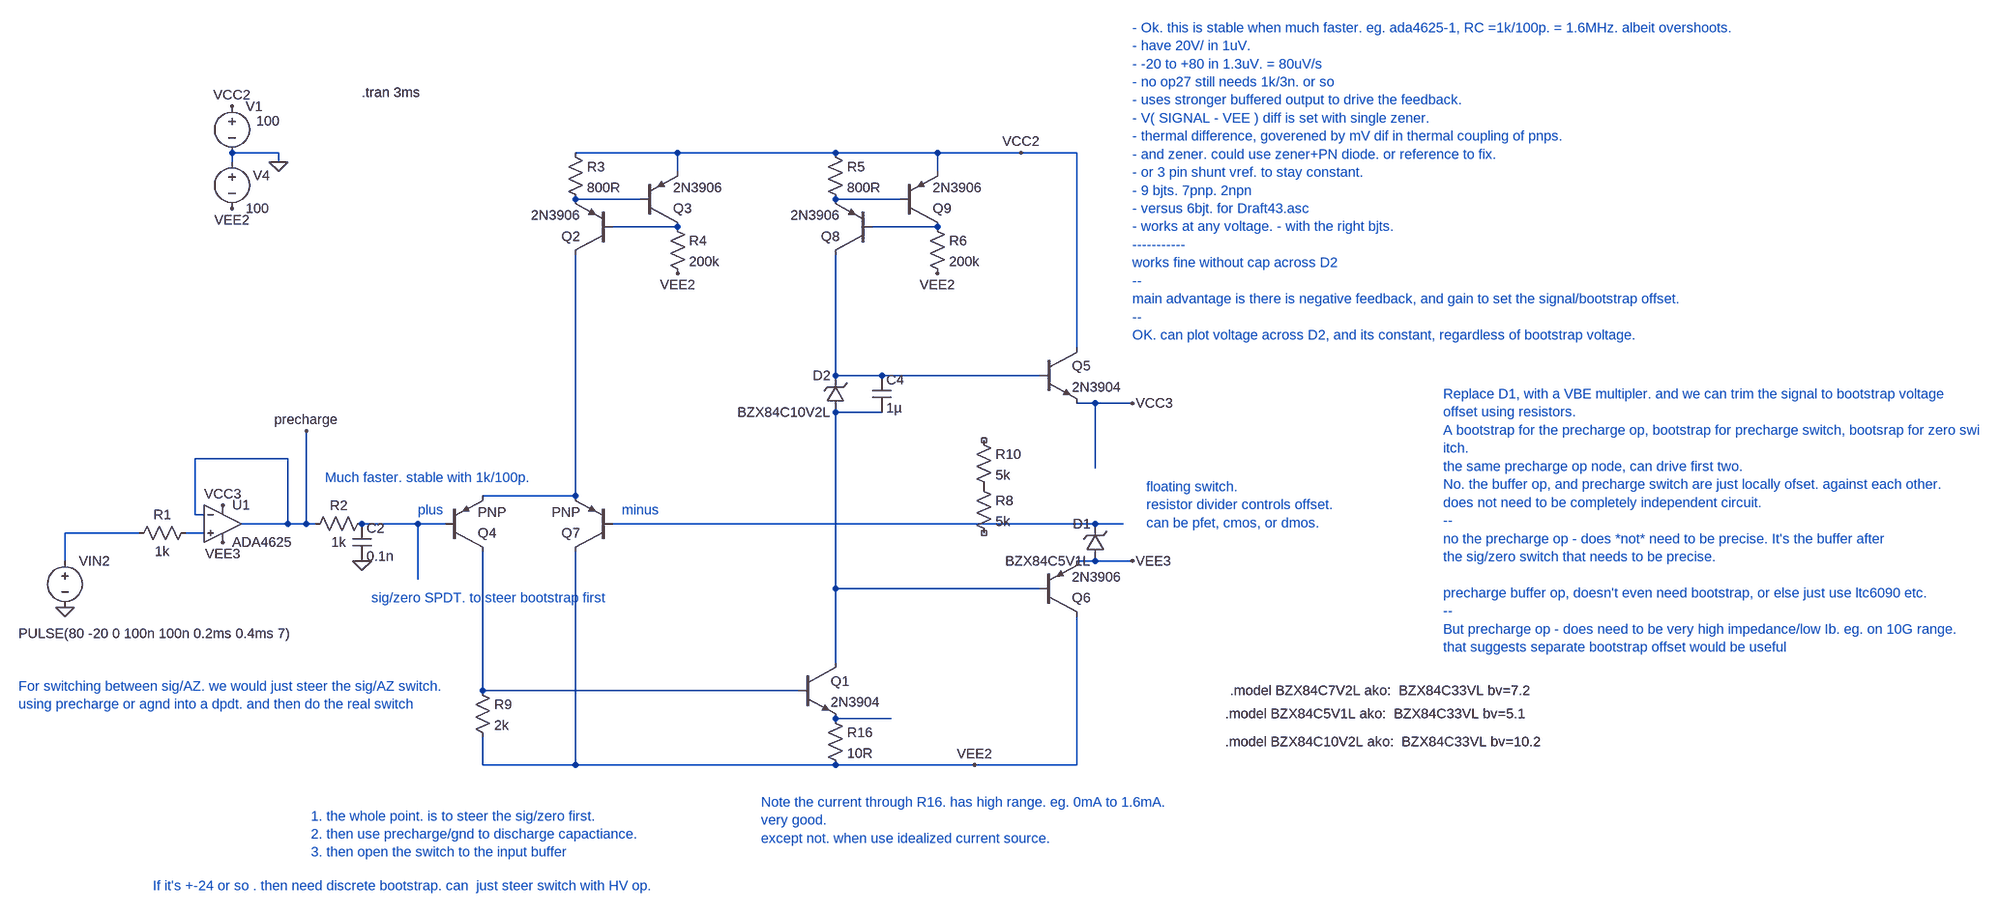
[diagram p0: schematic Draft51.asc]
Draft51.asc, the LTspice schematic file:
Version 4
SHEET 1 2756 992
WIRE -256 -288 -336 -288
WIRE 432 -288 256 -288
WIRE 704 -288 432 -288
WIRE 880 -288 704 -288
WIRE 1024 -288 880 -288
WIRE 1120 -288 1024 -288
WIRE -336 -272 -336 -288
WIRE -256 -272 -256 -288
WIRE 432 -256 432 -288
WIRE 880 -256 880 -288
WIRE 368 -208 256 -208
WIRE 816 -208 704 -208
WIRE 432 -160 320 -160
WIRE 880 -160 768 -160
WIRE 1120 48 1120 -288
WIRE 704 96 704 -112
WIRE 784 96 704 96
WIRE 1056 96 784 96
WIRE 1152 144 1120 144
WIRE 1216 144 1152 144
WIRE 784 160 704 160
WIRE -240 240 -400 240
WIRE 1152 256 1152 144
WIRE 256 304 256 -112
WIRE 256 304 96 304
WIRE -400 336 -400 240
WIRE -384 336 -400 336
WIRE -240 352 -240 240
WIRE -240 352 -320 352
WIRE -208 352 -208 192
WIRE -208 352 -240 352
WIRE -192 352 -208 352
WIRE -16 352 -112 352
WIRE 32 352 -16 352
WIRE 1152 352 320 352
WIRE 1200 352 1152 352
WIRE -496 368 -624 368
WIRE -384 368 -416 368
WIRE -624 416 -624 368
WIRE 1152 416 1120 416
WIRE 1216 416 1152 416
WIRE -16 448 -16 352
WIRE 704 464 704 160
WIRE 1056 464 704 464
WIRE 704 592 704 464
WIRE 96 640 96 400
WIRE 640 640 96 640
WIRE 800 688 704 688
WIRE 96 768 96 720
WIRE 256 768 256 400
WIRE 256 768 96 768
WIRE 704 768 256 768
WIRE 944 768 704 768
WIRE 1120 768 1120 512
WIRE 1120 768 944 768
FLAG -256 -272 0
FLAG -336 -368 VCC2
FLAG -336 -192 VEE2
FLAG 944 768 VEE2
FLAG -624 496 0
FLAG 1216 144 VCC3
FLAG 1216 416 VEE3
FLAG -352 320 VCC3
FLAG -352 384 VEE3
FLAG -112 416 0
FLAG 432 -80 VEE2
FLAG 1024 -288 VCC2
FLAG 880 -80 VEE2
FLAG -208 192 precharge
SYMBOL voltage -336 -384 R0
WINDOW 123 0 0 Left 0
WINDOW 39 0 0 Left 0
WINDOW 3 42 41 Left 2
SYMATTR Value 100
SYMATTR InstName V1
SYMBOL voltage -336 -288 R0
WINDOW 123 0 0 Left 0
WINDOW 39 0 0 Left 0
WINDOW 0 36 39 Left 2
SYMATTR InstName V4
SYMATTR Value 100
SYMBOL npn 1056 48 R0
SYMATTR InstName Q5
SYMATTR Value 2N3904
SYMBOL pnp 1056 512 M180
SYMATTR InstName Q6
SYMATTR Value 2N3906
SYMBOL res 80 624 R0
SYMATTR InstName R9
SYMATTR Value 2k
SYMBOL res 688 672 R0
SYMATTR InstName R16
SYMATTR Value 10R
SYMBOL pnp 32 400 M180
SYMATTR InstName Q4
SYMBOL pnp 320 400 R180
SYMATTR InstName Q7
SYMBOL voltage -624 400 R0
WINDOW 123 0 0 Left 0
WINDOW 39 0 0 Left 0
WINDOW 3 -80 141 Left 2
SYMATTR Value PULSE(80 -20 0 100n 100n 0.2ms 0.4ms 7)
SYMATTR InstName VIN2
SYMBOL res -400 352 R90
WINDOW 0 0 56 VBottom 2
WINDOW 3 32 56 VTop 2
SYMATTR InstName R1
SYMATTR Value 1k
SYMBOL res -96 336 R90
WINDOW 0 0 56 VBottom 2
WINDOW 3 32 56 VTop 2
SYMATTR InstName R2
SYMATTR Value 1k
SYMBOL cap -128 352 R0
SYMATTR InstName C2
SYMATTR Value 0.1n
SYMBOL cap 768 96 R0
SYMATTR InstName C4
SYMATTR Value 1µ
SYMBOL OpAmps\\ADA4625 -352 288 R0
SYMATTR InstName U1
SYMBOL zener 720 160 R180
WINDOW 0 24 64 Left 2
WINDOW 3 24 0 Left 2
SYMATTR InstName D2
SYMATTR Value BZX84C10V2L
SYMBOL npn 640 592 R0
SYMATTR InstName Q1
SYMATTR Value 2N3904
SYMBOL pnp 320 -112 R180
SYMATTR InstName Q2
SYMATTR Value 2N3906
SYMBOL pnp 368 -160 M180
SYMATTR InstName Q3
SYMATTR Value 2N3906
SYMBOL res 240 -304 R0
SYMATTR InstName R3
SYMATTR Value 800R
SYMBOL res 416 -176 R0
SYMATTR InstName R4
SYMATTR Value 200k
SYMBOL pnp 768 -112 R180
SYMATTR InstName Q8
SYMATTR Value 2N3906
SYMBOL pnp 816 -160 M180
SYMATTR InstName Q9
SYMATTR Value 2N3906
SYMBOL res 688 -304 R0
SYMATTR InstName R5
SYMATTR Value 800R
SYMBOL res 864 -176 R0
SYMATTR InstName R6
SYMATTR Value 200k
SYMBOL res 944 272 R0
SYMATTR InstName R8
SYMATTR Value 5k
SYMBOL res 944 192 R0
SYMATTR InstName R10
SYMATTR Value 5k
SYMBOL zener 1168 416 R180
WINDOW 0 24 64 Left 2
WINDOW 3 24 0 Left 2
SYMATTR InstName D1
SYMATTR Value BZX84C5V1L
TEXT -112 -392 Left 2 !.tran 3ms
TEXT 336 328 Left 2 ;minus
TEXT 576 832 Left 2 ;Note the current through R16. has high range. eg. 0mA to 1.6mA.\nvery good.\nexcept not. when use idealized current source.
TEXT -16 328 Left 2 ;plus
TEXT 1376 680 Left 2 !.model BZX84C5V1L ako:  BZX84C33VL bv=5.1
TEXT 1384 640 Left 2 !.model BZX84C7V2L ako:  BZX84C33VL bv=7.2
TEXT 1216 -504 Left 2 ;- Ok. this is stable when much faster. eg. ada4625-1, RC =1k/100p. = 1.6MHz. albeit overshoots.\n- have 20V/ in 1uV.\n- -20 to +80 in 1.3uV. = 80uV/s\n- no op27 still needs 1k/3n. or so\n- uses stronger buffered output to drive the feedback.\n- V( SIGNAL - VEE ) diff is set with single zener.\n- thermal difference, goverened by mV dif in thermal coupling of pnps.\n- and zener. could use zener+PN diode. or reference to fix.\n- or 3 pin shunt vref. to stay constant.\n- 9 bjts. 7pnp. 2npn\n- versus 6bjt. for Draft43.asc\n- works at any voltage. - with the right bjts.\n-----------\nworks fine without cap across D2\n--\nmain advantage is there is negative feedback, and gain to set the signal/bootstrap offset.\n--\nOK. can plot voltage across D2, and its constant, regardless of bootstrap voltage.
TEXT -176 272 Left 2 ;Much faster. stable with 1k/100p.
TEXT 1376 728 Left 2 !.model BZX84C10V2L ako:  BZX84C33VL bv=10.2
TEXT 1752 128 Left 2 ;Replace D1, with a VBE multipler. and we can trim the signal to bootstrap voltage\noffset using resistors.\nA bootstrap for the precharge op, bootstrap for precharge switch, bootsrap for zero swi\nitch.\nthe same precharge op node, can drive first two.\nNo. the buffer op, and precharge switch are just locally ofset. against each other.\ndoes not need to be completely independent circuit.\n--\nno the precharge op - does *not* need to be precise. It's the buffer after\nthe sig/zero switch that needs to be precise.\n \nprecharge buffer op, doesn't even need bootstrap, or else just use ltc6090 etc.\n--\nBut precharge op - does need to be very high impedance/low Ib. eg. on 10G range.\nthat suggests separate bootstrap offset would be useful
TEXT -704 632 Left 2 ;For switching between sig/AZ. we would just steer the sig/AZ switch.\nusing precharge or agnd into a dpdt. and then do the real switch
TEXT -96 480 Left 2 ;sig/zero SPDT. to steer bootstrap first
TEXT 1240 288 Left 2 ;floating switch. \nresistor divider controls offset.\ncan be pfet, cmos, or dmos.
TEXT -200 856 Left 2 ;1. the whole point. is to steer the sig/zero first. \n2. then use precharge/gnd to discharge capactiance.\n3. then open the switch to the input buffer
TEXT -472 976 Left 2 ;If it's +-24 or so . then need discrete bootstrap. can  just steer switch with HV op.

The netlist it stands for:
* Draft51.asc
V1 VCC2 0 100
V4 0 VEE2 100
Q5 VCC2 N005 VCC3 0 2N3904
Q6 VEE2 N006 VEE3 0 2N3906
R9 N012 VEE2 2k
R16 N013 VEE2 10R
Q4 N012 N008 N007 0 PNP
Q7 VEE2 N009 N007 0 PNP
VIN2 N010 0 PULSE(80 -20 0 100n 100n 0.2ms 0.4ms 7)
R1 N011 N010 1k
R2 N008 precharge 1k
C2 N008 0 0.1n
C4 N005 N006 1µ
XU1 N011 precharge VCC3 VEE3 precharge ADA4625  ; pins In+ In- V+ V- OUT
D2 N006 N005 BZX84C10V2L
Q1 N006 N012 N013 0 2N3904
Q2 N007 N003 N001 0 2N3906
Q3 N003 N001 VCC2 0 2N3906
R3 VCC2 N001 800R
R4 N003 VEE2 200k
Q8 N005 N004 N002 0 2N3906
Q9 N004 N002 VCC2 0 2N3906
R5 VCC2 N002 800R
R6 N004 VEE2 200k
R8 P001 NC_01 5k
R10 NC_02 P001 5k
D1 VEE3 N009 BZX84C5V1L
.model D D
.lib standard.dio
.model NPN NPN
.model PNP PNP
.lib standard.bjt
.tran 3ms
* minus
* Note the current through R16. has high range. eg. 0mA to 1.6mA.
* very good.
* except not. when use idealized current source.
* plus
.model BZX84C5V1L ako:  BZX84C33VL bv=5.1
.model BZX84C7V2L ako:  BZX84C33VL bv=7.2
* - Ok. this is stable when much faster. eg. ada4625-1, RC =1k/100p. = 1.6MHz. albeit overshoots.
* - have 20V/ in 1uV.
* - -20 to +80 in 1.3uV. = 80uV/s
* - no op27 still needs 1k/3n. or so
* - uses stronger buffered output to drive the feedback.
* - V( SIGNAL - VEE ) diff is set with single zener.
* - thermal difference, goverened by mV dif in thermal coupling of pnps.
* - and zener. could use zener+PN diode. or reference to fix.
* - or 3 pin shunt vref. to stay constant.
* - 9 bjts. 7pnp. 2npn
* - versus 6bjt. for Draft43.asc
* - works at any voltage. - with the right bjts.
* -----------
* works fine without cap across D2
* --
* main advantage is there is negative feedback, and gain to set the signal/bootstrap offset.
* --
* OK. can plot voltage across D2, and its constant, regardless of bootstrap voltage.
* Much faster. stable with 1k/100p.
.model BZX84C10V2L ako:  BZX84C33VL bv=10.2
* Replace D1, with a VBE multipler. and we can trim the signal to bootstrap voltage
* offset using resistors.
* A bootstrap for the precharge op, bootstrap for precharge switch, bootsrap for zero swi
* itch.
* the same precharge op node, can drive first two.
* No. the buffer op, and precharge switch are just locally ofset. against each other.
* does not need to be completely independent circuit.
* --
* no the precharge op - does *not* need to be precise. It's the buffer after
* the sig/zero switch that needs to be precise.
* precharge buffer op, doesn't even need bootstrap, or else just use ltc6090 etc.
* --
* But precharge op - does need to be very high impedance/low Ib. eg. on 10G range.
* that suggests separate bootstrap offset would be useful
* For switching between sig/AZ. we would just steer the sig/AZ switch.
* using precharge or agnd into a dpdt. and then do the real switch
* sig/zero SPDT. to steer bootstrap first
* floating switch.
* resistor divider controls offset.
* can be pfet, cmos, or dmos.
* 1. the whole point. is to steer the sig/zero first.
* 2. then use precharge/gnd to discharge capactiance.
* 3. then open the switch to the input buffer
* If it's +-24 or so . then need discrete bootstrap. can  just steer switch with HV op.
.backanno
.end